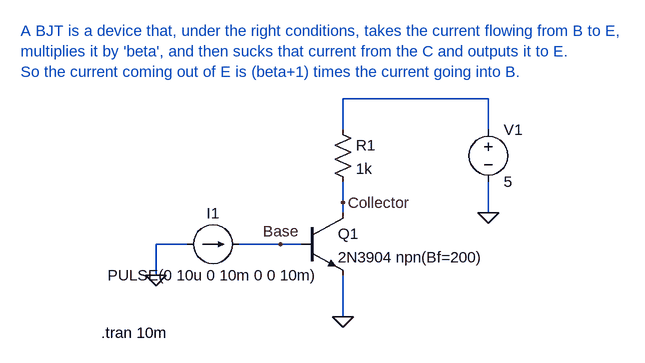
[diagram p0: schematic BjtBias.asc]
BjtBias.asc, the LTspice schematic file:
Version 4
SHEET 1 880 680
WIRE 512 -64 288 -64
WIRE 288 -16 288 -64
WIRE 512 -16 512 -64
WIRE 288 96 288 64
WIRE 288 112 288 96
WIRE 512 112 512 64
WIRE 48 160 0 160
WIRE 192 160 128 160
WIRE 224 160 192 160
WIRE 0 208 0 160
WIRE 288 272 288 208
FLAG 0 208 0
FLAG 288 272 0
FLAG 512 112 0
FLAG 192 160 Base
FLAG 288 96 Collector
SYMBOL current 48 160 R270
WINDOW 0 32 40 VTop 2
WINDOW 3 -32 40 VBottom 2
WINDOW 123 0 0 Left 0
WINDOW 39 0 0 Left 0
SYMATTR InstName I1
SYMATTR Value PULSE(0 10u 0 10m 0 0 10m)
SYMBOL npn 224 112 R0
SYMATTR InstName Q1
SYMATTR Value 2N3904 npn(Bf=200)
SYMBOL res 272 -32 R0
SYMATTR InstName R1
SYMATTR Value 1k
SYMBOL voltage 512 -32 R0
WINDOW 123 0 0 Left 0
WINDOW 39 0 0 Left 0
SYMATTR InstName V1
SYMATTR Value 5
TEXT -84 296 Left 2 !.tran 10m
TEXT -208 -168 Left 2 ;A BJT is a device that, under the right conditions, takes the current flowing from B to E,\nmultiplies it by 'beta', and then sucks that current from the C and outputs it to E.\nSo the current coming out of E is (beta+1) times the current going into B.

The netlist it stands for:
* BjtBias.asc
I1 0 Base PULSE(0 10u 0 10m 0 0 10m)
Q1 Collector Base 0 0 2N3904 npn(Bf=200)
R1 N001 Collector 1k
V1 N001 0 5
.model NPN NPN
.model PNP PNP
.lib standard.bjt
.tran 10m
* A BJT is a device that, under the right conditions, takes the current flowing from B to E,
* multiplies it by 'beta', and then sucks that current from the C and outputs it to E.
* So the current coming out of E is (beta+1) times the current going into B.
.backanno
.end